# Altium schematic sheet steering_controller.SchDoc
size A; SheetNumber: 1; SheetTotal: 2
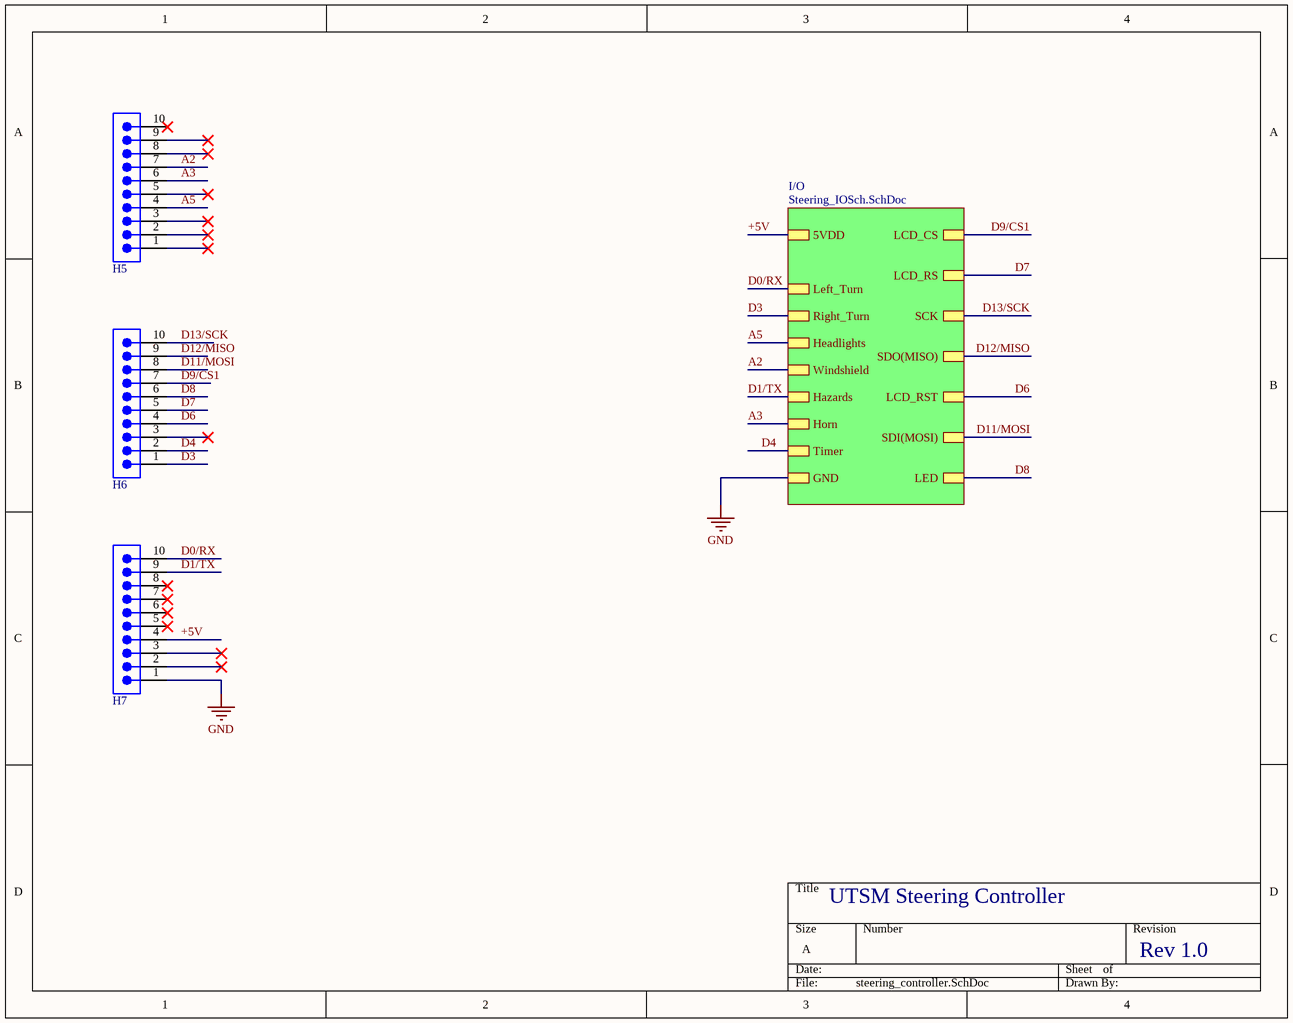
[diagram p0: steering_controller.SchDoc]

## Parts
H5  61301011121  [61301011121]  (value not drawn)
H6  61301011121  [61301011121]  (value not drawn)
H7  61301011121  [61301011121]  (value not drawn)

## Sub-sheets
I/O = Steering_IOSch.SchDoc: 5VDD, GND, Left_Turn, Right_Turn, Headlights, Windshield, Hazards, LCD_CS, LCD_RS, SCK, SDO(MISO), LCD_RST, SDI(MOSI), LED, Horn, Timer

## Nets
GND: H7.1 ; sheet I/O/GND
+5V: H7.4 ; sheet I/O/5VDD
A2: H5.7 ; sheet I/O/Windshield
A3: H5.6 ; sheet I/O/Horn
A5: H5.4 ; sheet I/O/Headlights
D0/RX: H7.10 ; sheet I/O/Left_Turn
D1/TX: H7.9 ; sheet I/O/Hazards
D3: H6.1 ; sheet I/O/Right_Turn
D4: H6.2 ; sheet I/O/Timer
D6: H6.4 ; sheet I/O/LCD_RST
D7: H6.5 ; sheet I/O/LCD_RS
D8: H6.6 ; sheet I/O/LED
D9/CS1: H6.7 ; sheet I/O/LCD_CS
D11/MOSI: H6.8 ; sheet I/O/SDI(MOSI)
D12/MISO: H6.9 ; sheet I/O/SDO(MISO)
D13/SCK: H6.10 ; sheet I/O/SCK

Not connected (* = marked no-connect by the designer): H5 1* 2* 3* 5* 8* 9* 10*; H6 3*; H7 2* 3* 5* 6* 7* 8*

## Notes on the sheet
- UTSM Steering Controller
- Rev 1.0

## Library data of the parts
H5-H7 = 61301011121: WR-PHD Pin Header, THT, Vertical, pitch 2.54mm, 1 Row, 10P; Manufacturer: Wurth Elektronik; Contact Resistance: 20mOhm; Rated Current: 3A; Working Voltage: 250V; Withstanding Voltage: 500V; Manufacturer Part Number: 61301011121; Category: Board-to-Board Connectors; Match Code: WR-PHD; ComponentLink1Description: Website Link; ComponentLink1URL: https://www.we-online.com/redexpert/article/61301011121?ad; ComponentLink2Description: Datasheet Link; ComponentLink2URL: https://www.we-online.com/redexpert/spec/61301011121?ad; Mount: Through Hole; Operating Temperature Max: 105°C; Operating Temperature Min: -40°C; Packaging: Bag; Gender: Pin Header; Number of Pins: 10; Number of Rows: 1; Orientation: Vertical; Pitch: 2.54mm